# Altium schematic sheet ILI9341_4Wire.SchDoc: LCD(ER-TFT032-3.1)
size 209 x 148 mm; DocumentNumber: 5; SheetNumber: 5; SheetTotal: 10
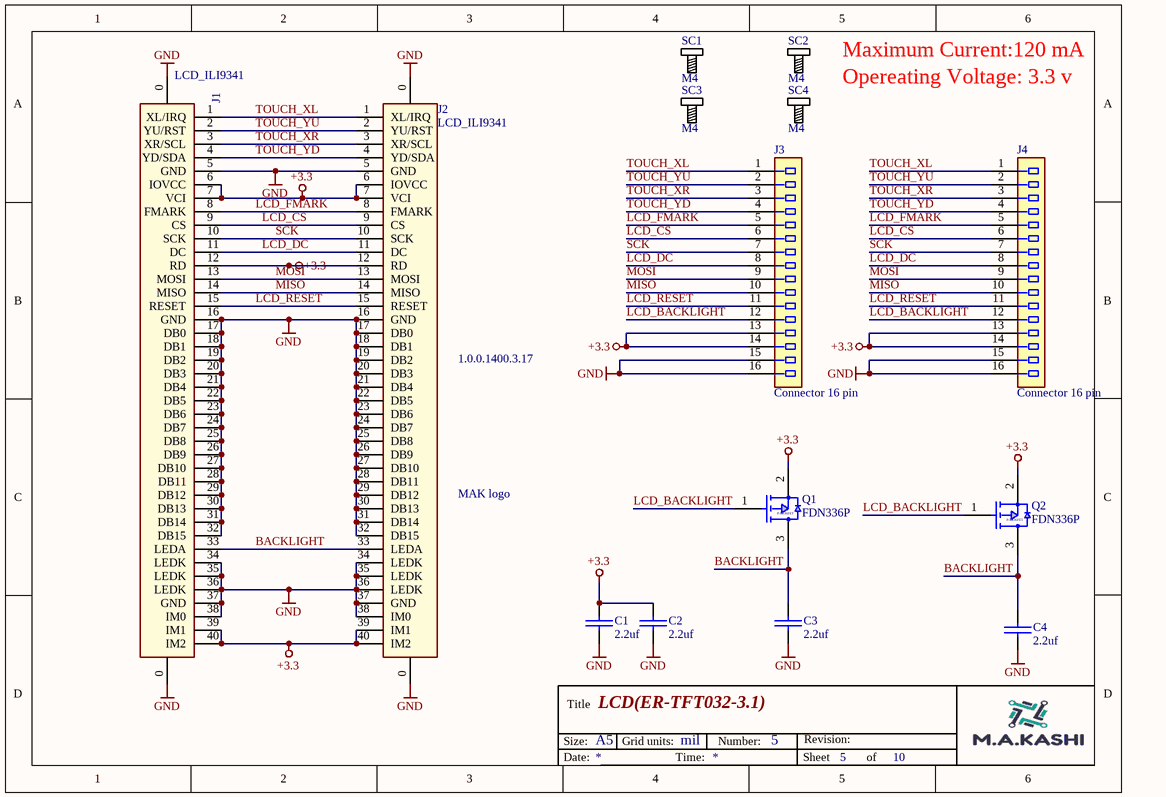
[diagram p0: ILI9341_4Wire.SchDoc]

## Parts
1.0.0.1400.3.17  MAK logo  [MAk LOGO]
C1  2.2uf  [cap_0805_B]
C2  2.2uf  [cap_0805_B]
C3  2.2uf  [cap_0805_B]
C4  2.2uf  [cap_0805_B]
J1  value LCD_ILI9341  [FPC 40 - top]  (hidden comment: Farnell no: 1112564)
J2  value LCD_ILI9341  [FPC 40 - bottom]  (hidden comment: Farnell no: 1112564)
J3  Connector 16 pin  [DS1013-16S - with Latch/Eject Levers]
J4  Connector 16 pin  [DS1013-16S - with Latch/Eject Levers]
Q1  FDN336P  [Diodes_Inc_SOT23_IPC_A]
Q2  FDN336P  [Diodes_Inc_SOT23_IPC_A]
SC1  M4  [SCREW_M4]
SC2  M4  [SCREW_M4]
SC3  M4  [SCREW_M4]
SC4  M4  [SCREW_M4]

## Nets
+3.3: C1.2 C2.2 J1.6(IOVCC) J1.7(VCI) J1.12(RD) J1.39(IM1) J1.40(IM2) J2.6(IOVCC) J2.7(VCI) J2.12(RD) J2.39(IM1) J2.40(IM2) J3.13 J3.14 J4.13 J4.14 Q1.2(S) Q2.2(S)
GND: C1.1 C2.1 C3.2 C4.2 J1.0 J1.5(GND) J1.16(GND) J1.17(DB0) J1.18(DB1) J1.19(DB2) J1.20(DB3) J1.21(DB4) J1.22(DB5) J1.23(DB6) J1.24(DB7) J1.25(DB8) J1.26(DB9) J1.27(DB10) J1.28(DB11) J1.29(DB12) J1.30(DB13) J1.31(DB14) J1.32(DB15) J1.34(LEDK) J1.35(LEDK) J1.36(LEDK) J1.37(GND) J1.38(IM0) J2.0 J2.5(GND) J2.16(GND) J2.17(DB0) J2.18(DB1) J2.19(DB2) J2.20(DB3) J2.21(DB4) J2.22(DB5) J2.23(DB6) J2.24(DB7) J2.25(DB8) J2.26(DB9) J2.27(DB10) J2.28(DB11) J2.29(DB12) J2.30(DB13) J2.31(DB14) J2.32(DB15) J2.34(LEDK) J2.35(LEDK) J2.36(LEDK) J2.37(GND) J2.38(IM0) J3.15 J3.16 J4.15 J4.16
BACKLIGHT: C3.1 C4.1 J1.33(LEDA) J2.33(LEDA) Q1.3(D) Q2.3(D)
LCD_BACKLIGHT: J3.12 J4.12 Q1.1(G) Q2.1(G)
LCD_CS: J1.9(CS) J2.9(CS) J3.6 J4.6
LCD_DC: J1.11(DC) J2.11(DC) J3.8 J4.8
LCD_FMARK: J1.8(FMARK) J2.8(FMARK) J3.5 J4.5
LCD_RESET: J1.15(RESET) J2.15(RESET) J3.11 J4.11
MISO: J1.14(MISO) J2.14(MISO) J3.10 J4.10
MOSI: J1.13(MOSI) J2.13(MOSI) J3.9 J4.9
SCK: J1.10(SCK) J2.10(SCK) J3.7 J4.7
TOUCH_XL: J1.1(XL/IRQ) J2.1(XL/IRQ) J3.1 J4.1
TOUCH_XR: J1.3(XR/SCL) J2.3(XR/SCL) J3.3 J4.3
TOUCH_YD: J1.4(YD/SDA) J2.4(YD/SDA) J3.4 J4.4
TOUCH_YU: J1.2(YU/RST) J2.2(YU/RST) J3.2 J4.2

## Notes on the sheet
- Maximum Current:120 mA
- Opereating Voltage: 3.3 v
- Size:
- Title
- A5
- Grid units:
- mil
- Number:
- Revision:
- Date:
- Time:
- Sheet
- of
- (in symbol DMP3099L-13_1) P-MOSFET

## Library data of the parts
C1 C2 = Capacitor: octopart or digikey description!; Part Number: C0402X7R160-104KNE; Capacitance: 2.2uf; Voltage Rating: *
C3 C4 = Capacitor: octopart or digikey description!; Part Number: CL21A106KOQNNNG; Voltage Rating: 16v; Capacitance: 2.2uf
J1 J2 = LCD_ILI9341: 50pin FPC connector, 0.5mm pitch, Top/Bottom contacts; PartGroup: Mechanical devices,Connectors,PCB - receptacle; Manufacturer: Omron Components; MPN: XF2M-5015-1A; AN: A08-1731; TemperatureRange: -30°C to +85°C
Q1 Q2 = DMP3099L-13_1: Part Number: DMP3099L-13
SC1-SC4 = Screw_M4: Screw
J3 J4 = Connector 16 pin
  J3: System: Connector